# Altium project UPS.PrjPcb (part 3 of 3)

## Sheet BuckBoost.SchDoc
size A4; SheetNumber: 5; SheetTotal: 5
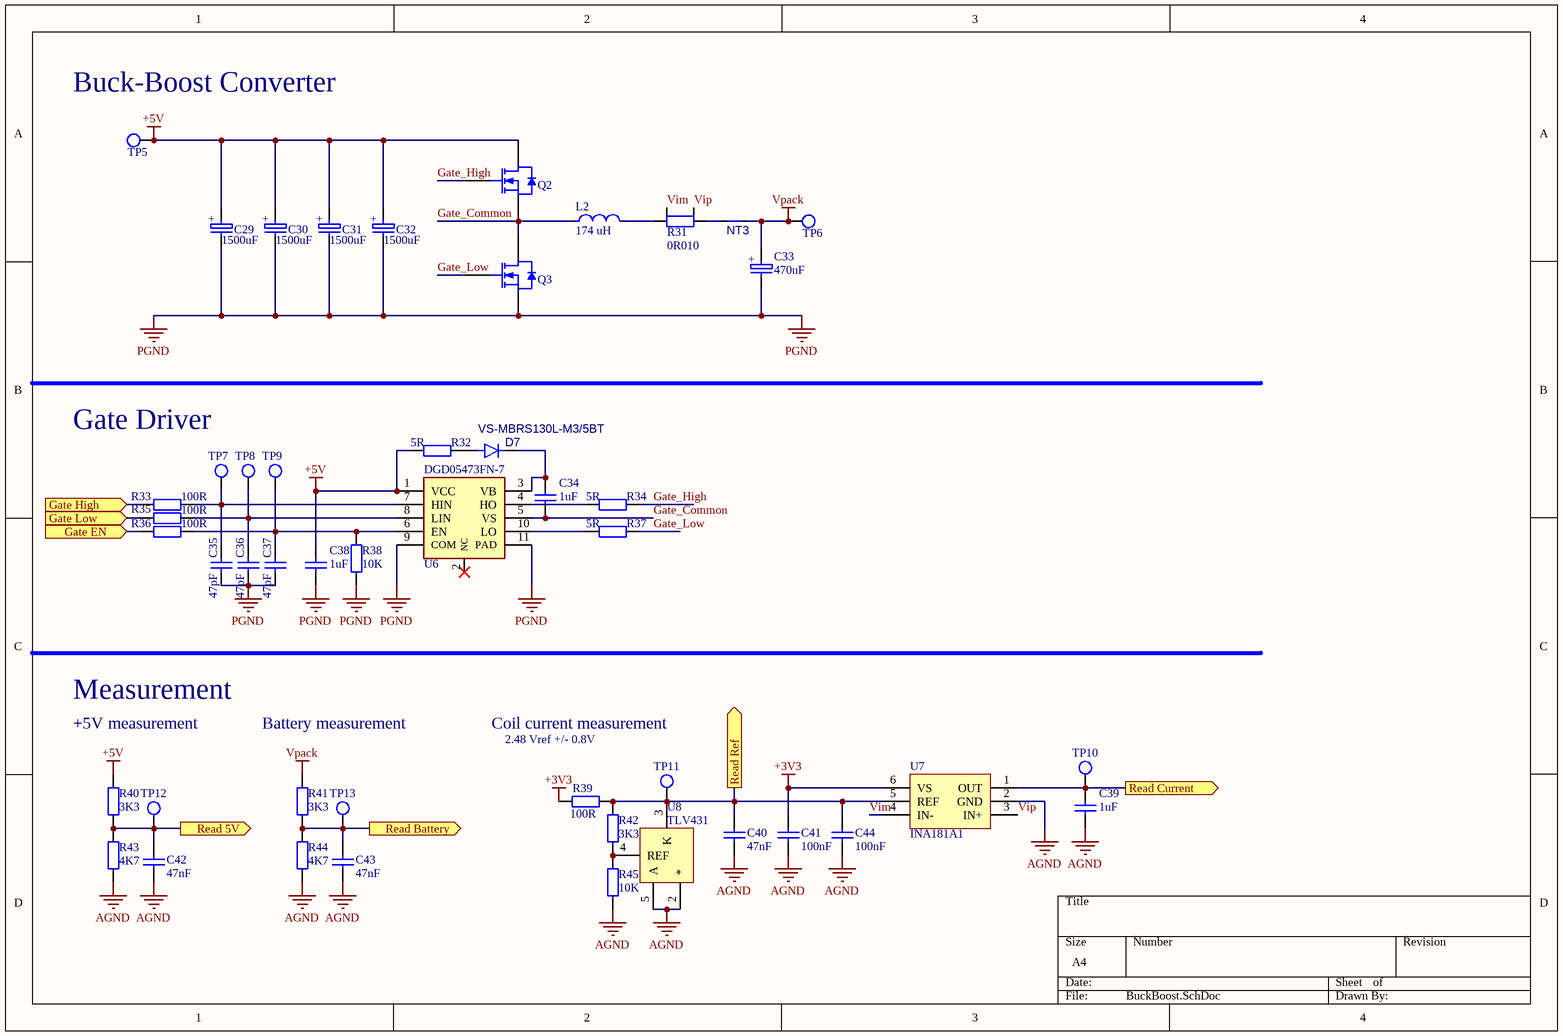
[diagram p4: BuckBoost.SchDoc]

### Parts
C29  value 1500uF  [Aluminium Capacitor 10x12.5]  (hidden comment: RNU0J152MDN1PH)
C30  value 1500uF  [Aluminium Capacitor 10x12.5]  (hidden comment: RNU0J152MDN1PH)
C31  value 1500uF  [Aluminium Capacitor 10x12.5]  (hidden comment: RNU0J152MDN1PH)
C32  value 1500uF  [Aluminium Capacitor 10x12.5]  (hidden comment: RNU0J152MDN1PH)
C33  470uF  [Aluminium Capacitor 10x12.5]
C34  1uF  [CAP0603]
C35  47pF  [CAP0603]
C36  47pF  [CAP0603]
C37  47pF  [CAP0603]
C38  1uF  [CAP0603]
C39  1uF  [CAP0603]
C40  47nF  [CAP0603]
C41  100nF  [CAP0603]
C42  47nF  [CAP0603]
C43  47nF  [CAP0603]
C44  100nF  [CAP0603]
D7  VS-MBRS130L-M3/5BT  [SMB]
L2  value 174 uH  [COIL_HANDMADE]  (hidden comment: Inductor)
NT3  NetTie_1-1  [NETTIE_1.85MM]  (value not drawn)  (net tie, no BOM)
Q2  N-MOSFET  [SOT-669-5]  (value not drawn)
Q3  N-MOSFET  [SOT-669-5]  (value not drawn)
R31  0R010  [RES1206_KELVIN]
R32  5R  [RES0603]
R33  100R  [RES0603]
R34  5R  [RES0603]
R35  100R  [RES0603]
R36  100R  [RES0603]
R37  5R  [RES0603]
R38  10K  [RES0603]
R39  100R  [RES0603]
R40  3K3  [RES0603]
R41  3K3  [RES0603]
R42  3K3  [RES0603]
R43  4K7  [RES0603]
R44  4K7  [RES0603]
R45  10K  [RES0603]
TP5  Test Point  [TP-1.5HOLE]  (value not drawn)
TP6  Test Point  [TP-1.5HOLE]  (value not drawn)
TP7  Test Point  [TP-1.5HOLE]  (value not drawn)
TP8  Test Point  [TP-1.5HOLE]  (value not drawn)
TP9  Test Point  [TP-1.5HOLE]  (value not drawn)
TP10  Test Point  [TP-1.5HOLE]  (value not drawn)
TP11  Test Point  [TP-1.5HOLE]  (value not drawn)
TP12  Test Point  [TP-1.5HOLE]  (value not drawn)
TP13  Test Point  [TP-1.5HOLE]  (value not drawn)
U6  DGD05473FN-7  [V-DFN3030-10]
U7  INA181A1  [SOT23-6]
U8  TLV431  [SOT23-5]

### Ports
Gate EN (in, see Main[2C], uC[3C]), Gate High (in, see Main[2C], uC[3C]), Gate Low (in, see Main[2C], uC[3C]), Read 5V (out, see Main[2C], uC[1C]), Read Battery (out, see Main[2C], uC[1C]), Read Current (out, see Main[2C], uC[1C]), Read Ref (out, see Main[2C], uC[1C])

### Nets
+3V3: C41.1 R39.1 U7.6(VS)
+5V: C29.2(A) C30.2(A) C31.2(A) C32.2(A) C38.2 Q2.3(D) R32.1 R40.2 TP5.1 U6.1(VCC)
AGND: C39.1 C40.1 C41.2 C42.1 C43.1 C44.2 R43.1 R44.1 R45.1 U7.2(GND) U8.2 U8.5(A)
PGND: C29.1(C) C30.1(C) C31.1(C) C32.1(C) C33.1(C) C35.1 C36.1 C37.1 C38.1 Q3.2(S) R38.2 U6.9(COM) U6.11(PAD)
Vpack: C33.2(A) NT3.2 R41.2 TP6.1
Gate EN: R36.1 ; port Gate EN
Gate High: R33.1 ; port Gate High
Gate Low: R35.1 ; port Gate Low
Gate_Common: C34.1 L2.1 Q2.2(S) Q3.3(D) U6.5(VS)
Gate_High: Q2.1(G) R34.2
Gate_Low: Q3.1(G) R37.2
Read 5V: C42.2 R40.1 R43.2 TP12.1 ; port Read 5V
Read Battery: C43.2 R41.1 R44.2 TP13.1 ; port Read Battery
Read Current: C39.2 TP10.1 U7.1(OUT) ; port Read Current
Read Ref: C40.2 C44.1 R39.2 R42.2 TP11.1 U7.5(REF) U8.3(K) ; port Read Ref
Vim: R31.3 U7.4(IN-)
Vip: R31.4 U7.3(IN+)
NetC34_2: C34.2 D7.1(K) U6.3(VB)
NetC35_2: C35.2 R33.2 TP7.1 U6.7(HIN)
NetC36_2: C36.2 R35.2 TP8.1 U6.8(LIN)
NetC37_2: C37.2 R36.2 R38.1 TP9.1 U6.6(EN)
NetD7_2: D7.2(A) R32.2
NetL2_2: L2.2 R31.1
NetNT3_1: NT3.1 R31.2
NetR34_1: R34.1 U6.4(HO)
NetR37_1: R37.1 U6.10(LO)
NetR42_1: R42.1 R45.2 U8.4(REF)

Not connected (* = marked no-connect by the designer): U6 2(NC)*

### Notes on the sheet
- (near TP5) Buck-Boost Converter
- Gate Driver
- Measurement
- +5V measurement
- Battery measurement
- Coil current measurement
- 2.48 Vref +/- 0.8V
- (in symbol RNU0J152MDN1PH) +
- (in symbol RR50J471MDN1KX) +
- (in symbol 1500uF) +

### Library data of the parts
C29-C32 = RNU0J152MDN1PH: Aluminum Electrolytic Capacitor, Polarized, Aluminum (solid Polymer), 6.3V, 20% +Tol, 20% -Tol, 1500uF, Through Hole Mount; Manufacturer: Nichicon; Manufacturer Series: NU; Dielectric Material: Aluminium; ESR (Equivalent Series Resistance): 7mR; Leakage Current: 1.89mA; Ripple Current: 6.1A; Tan Delta: 0.08; Supplier: Future Electronics; Supplier Part Number: 4133684; Manufacturer Part Number: RNU0J152MDN1PH; RoHS: Yes; Category: Polymer Capacitors; Stock: 1000; Pricing: 500=0.37, 1000=0.36, 2000=0.35, 2500=0.35, 7500=0.335 (USD); Mounting Technology: Through Hole; Pins: 2; Package Shape: Cylindrical; Terminal Finish: Tin; Min Operating Temperature: -55°C; Max Operating Temperature: 105°C; JESD-609 Code: e3; Polarity: Polarized; Capacitor Type: Aluminium; Tolerance  (fill in as +-): 20%; Package Style: RadialMeter; Packaging: Tape and Reel; Tolerance (fill in as +-): 20%; Rated DC Voltage (URdc): 6.3V; Series: NU; Termination: Wire; Diameter: 10mm; Length: 12.5mm; Terminal Pitch: 5mm; Reach SVHC Compliant: Yes; RoHS Compliant: Yes; ComponentLink1URL: https://datasheet.ciiva.com:443/pdfs/VipMasterIC/IC/NICH/NICH-S-A0001375683/NICH-S-A0001375683-1.pdf?src-supplier=IHS+Markit; ComponentLink1Description: https://datasheet.ciiva.com:443/pdfs/VipMasterIC/IC/NICH/NICH-S-A0001375683/NICH-S-A0001375683-1.pdf?src-supplier=IHS+Markit; ComponentLink2URL: https://datasheet.ciiva.com/6316/2013fpcap-catalog-nu-6316953.pdf?src-supplier=Digikey; ComponentLink2Description: https://datasheet.ciiva.com/6316/2013fpcap-catalog-nu-6316953.pdf?src-supplier=Digikey; ComponentLink3URL: https://datasheet.ciiva.com/6316/2013fpcap-catalog-nu-6316955.pdf?src-supplier=Digikey; ComponentLink3Description: https://datasheet.ciiva.com/6316/2013fpcap-catalog-nu-6316955.pdf?src-supplier=Digikey
C33 = RR50J471MDN1KX: Aluminum Electrolytic Capacitor, Aluminum (solid Polymer); Manufacturer: Nichicon; Dielectric Material: Aluminium; Supplier: Mouser; Supplier Part Number: 647-RR50J471MDN1KX; Manufacturer Part Number: RR50J471MDN1KX; RoHS: Yes; Category: Polymer Capacitors; Stock: 272; Pricing: 1=0.65, 10=0.409, 50=0.409, 100=0.334, 1000=0.265, 10000=0.265 (USD); Pins: 2; Capacitor Type: Aluminium; Reach SVHC Compliant: Yes; RoHS Compliant: Yes; ComponentLink1URL: https://datasheet.ciiva.com:443/pdfs/VipMasterIC/IC/NICH/NICH-S-A0003527494/NICH-S-A0003527494-1.pdf?src-supplier=IHS+Markit; ComponentLink1Description: https://datasheet.ciiva.com:443/pdfs/VipMasterIC/IC/NICH/NICH-S-A0003527494/NICH-S-A0003527494-1.pdf?src-supplier=IHS+Markit; ComponentLink2URL: http://www.mouser.com/ds/2/293/e-rr5-875910.pdf?src-supplier=Mouser; ComponentLink2Description: http://www.mouser.com/ds/2/293/e-rr5-875910.pdf?src-supplier=Mouser; ComponentLink3URL: http://nichicon-us.com/english/products/pdfs/e-rr5.pdf?src-supplier=Digikey; ComponentLink3Description: http://nichicon-us.com/english/products/pdfs/e-rr5.pdf?src-supplier=Digikey; Value: 470uF
C34 C38 C39 = 1uF: Capacitor; Voltage: *; Value: 1uF
C35-C37 = 47pF: Ceramic Capacitor, Multilayer, Ceramic, 100V, 5% +Tol, 5% -Tol, C0G, 30ppm/Cel TC, 0.000047uF, Surface Mount, 0603; Manufacturer: KEMET; Manufacturer Part Number: C0603C470J1GACTU; Multilayer: Yes; Voltage: *; Supplier: Mouser; Supplier Part Number: 80-C0603C470J1G; RoHS: Yes; Category: Ceramic Capacitors; Stock: 43381; Pricing: 1=0.1, 10=0.026, 50=0.026, 100=0.016, 1000=0.012, 10000=0.007 (USD); Mounting Technology: Surface Mount; Pins: 2; Dielectric Material: Ceramic; Package Shape: Rectangular; Case/Package: 0603; Terminal Finish: Nickel; Min Operating Temperature: -55°C; Max Operating Temperature: 125°C; JESD-609 Code: e3; Capacitor Type: Ceramic; Tolerance  (fill in as +-): 5%; Package Style: SMTMeter; Packaging: Tape and Reel; Tolerance (fill in as +-): 5%; Rated DC Voltage (URdc): 100V; Temperature Characteristics Code: C0G; Termination: Wraparound; Length: 1.6mm; Width: 0.8mm; Height: 0.8mm; Reach SVHC Compliant: Yes; RoHS Compliant: Yes; ComponentLink1URL: https://datasheet.ciiva.com:443/pdfs/VipMasterIC/IC/KEME/KEME-S-A0005605168/KEME-S-A0005605168-1.pdf?src-supplier=IHS+Markit; ComponentLink1Description: https://datasheet.ciiva.com:443/pdfs/VipMasterIC/IC/KEME/KEME-S-A0005605168/KEME-S-A0005605168-1.pdf?src-supplier=IHS+Markit; ComponentLink2URL: https://datasheet.ciiva.com/28668/1789732-28668693.pdf?src-supplier=Element14; ComponentLink2Description: https://datasheet.ciiva.com/28668/1789732-28668693.pdf?src-supplier=Element14; ComponentLink3URL: https://datasheet.ciiva.com/18193/getdatasheetpartid-544691-18193046.pdf?src-supplier=Verical; ComponentLink3Description: https://datasheet.ciiva.com/18193/getdatasheetpartid-544691-18193046.pdf?src-supplier=Verical; ComponentLink4URL: https://datasheet.ciiva.com/18101/getdatasheetpartid-38001-18101098.pdf?src-supplier=Verical; ComponentLink4Description: https://datasheet.ciiva.com/18101/getdatasheetpartid-38001-18101098.pdf?src-supplier=Verical; Value: 47pF
C40 C42 C43 = 47nF: Capacitor; Voltage: *; Value: 47nF
C41 C44 = 100nF: Capacitor; Voltage: *; Value: 100nF
D7 = VS-MBRS130L-M3/5BT: Rectifier Diode, Schottky, 1 Phase, 1 Element, 30V V(RRM), Silicon; Manufacturer: Vishay Semiconductors; Package Body Material: Plastic; Additional Feature: FREE WHEELING DIODE; Number of Elements: 1; If: 1 A; Vf: 300 mV; Supplier: Mouser; Supplier Part Number: 78-VS-MBRS130L-M35BT; Manufacturer Part Number: VS-MBRS130L-M3/5BT; RoHS: Yes; Category: Rectifier Diodes; Stock: 107658; Pricing: 1=0.26, 10=0.211, 50=0.211, 100=0.15, 1000=0.105, 10000=0.08 (USD); Pins: 2; Diode Element Material: SILICON; Package Shape: Rectangular; Terminal Finish: Tin; Min Operating Temperature: -55°C; Max Operating Temperature: 125°C; JESD-609 Code: e3; Diode Type: RECTIFIER; JESD-30 Code: R-PDSO-C2; Moisture Sensitivity Level: 1; Package Style: SMALL OUTLINEMeter; Rep Pk Reverse Voltage-Max: 30V; Surface Mount: Yes; Technology: SCHOTTKY; Terminal Form: C BEND; Terminal Position: DUAL; RoHS Compliant: Yes; Reach SVHC Compliant: No; ComponentLink1URL: https://datasheet.ciiva.com:443/pdfs/VipMasterIC/IC/VISH/VISH-S-A0001785244/VISH-S-A0001785244-1.pdf?src-supplier=IHS+Markit; ComponentLink1Description: https://datasheet.ciiva.com:443/pdfs/VipMasterIC/IC/VISH/VISH-S-A0001785244/VISH-S-A0001785244-1.pdf?src-supplier=IHS+Markit; ComponentLink2URL: http://www.mouser.com/ds/2/427/vsmbrs130lm3-552915.pdf?src-supplier=Mouser; ComponentLink2Description: http://www.mouser.com/ds/2/427/vsmbrs130lm3-552915.pdf?src-supplier=Mouser; ComponentLink3URL: http://www.vishay.com/docs/95745/vsmbrs130lm3.pdf?src-supplier=Digikey; ComponentLink3Description: http://www.vishay.com/docs/95745/vsmbrs130lm3.pdf?src-supplier=Digikey; ComponentLink4URL: https://datasheet.octopart.com/VS-MBRS130L-M3-5BT-Vishay-datasheet-41960962.pdf?src-supplier=Future+Electronics; ComponentLink4Description: https://datasheet.octopart.com/VS-MBRS130L-M3-5BT-Vishay-datasheet-41960962.pdf?src-supplier=Future+Electronics; Vrrm: 30 V
L2 = Inductor: Hand made inductance
NT3 = NetTie_1-1: NetTie 1 -> 1; ID: 22; Value: NetTie 1-1 0.2mm; Inventory_Category: Other; Part Class: NetTie; Technology: SMT
Q2 Q3 = PSMN1R2-25YLDX: Power Field-Effect Transistor, 100A I(D), 25V, 0.00169ohm, 1-Element, N-Channel, Silicon, Metal-oxide Semiconductor FET, MO-235; Manufacturer: Nexperia; Package Body Material: Plastic; Additional Feature: HIGH RELIABILITY; Avalanche Energy Rating (Eas): 1293mJ; Case Connection: DRAIN; Drain-source On Resistance-Max: 1.69mR; Number of Elements: 1; Operating Mode: ENHANCEMENT MODE; Pulsed Drain Current-Max (IDM): 1.163kA; Transistor Application: SWITCHING; Reference Standard: IEC-60134; Supplier: Mouser; Supplier Part Number: 771-PSMN1R2-25YLDX; Manufacturer Part Number: PSMN1R2-25YLDX; RoHS: Yes; Category: Transistors; Stock: 20971; Pricing: 1=0.7, 10=0.694, 50=0.694, 100=0.663, 1000=0.483, 10000=0.481 (USD); Pins: 4; Package Shape: Rectangular; Transistor Element Material: SILICON; Polarity/Channel Type: N-CHANNEL; Drain Current-Max (ID): 100A; DS Breakdown Voltage-Min: 25V; FET Technology: METAL-OXIDE SEMICONDUCTOR; Package Style: SMALL OUTLINEMeter; Surface Mount: Yes; Terminal Form: Gull Wing; Terminal Position: SINGLE; JEDEC-95 Code: MO-235; Reach SVHC Compliant: No; RoHS Compliant: Yes; ComponentLink1URL: https://datasheet.ciiva.com:443/pdfs/VipMasterIC/IC/NEXP/NEXP-S-A0003107917/NEXP-S-A0003107917-1.pdf?src-supplier=IHS+Markit; ComponentLink1Description: https://datasheet.ciiva.com:443/pdfs/VipMasterIC/IC/NEXP/NEXP-S-A0003107917/NEXP-S-A0003107917-1.pdf?src-supplier=IHS+Markit
R31 = 0R010: Resistor Current Sense Metal Foil 1206 10m Ohm 1% 1W ±50ppm/°C T/R; Manufacturer: Eaton; Manufacturer Part Number: MFSA1206R0050FCM; Supplier Part Number: 504-MFSA1206R0050FCM; RoHS: No; Category: Chip SMD Resistors; Stock: 9199; Pricing: 1=0.21, 10=0.173, 50=0.173, 100=0.128, 1000=0.096, 10000=0.062 (USD); Temperature Coefficient: 50ppm/°C; Value: 0R010
R32 R34 R37 = 5R: Resistor; Value: 5R
R33 R35 R36 R39 = 100R: Resistor; Value: 100R
R38 R45 = 10K: Resistor; Value: 10K
R40-R42 = 3K3: Fixed Resistor, Metal Glaze/thick Film, 0.1W, 3300ohm, 75V, 1% +/-Tol, 150ppm/Cel, Surface Mount, 0603; Manufacturer: Yageo; Manufacturer Part Number: RC0603FR-073K3P; Additional Feature: LASER TRIMMABLE; Rated Temperature: 70°C; Temperature Coefficient: 150ppm/°C; Supplier Part Number: 603-RC0603FR-073K3P; RoHS: Yes; Category: Chip SMD Resistors; Stock: 14148; Pricing: 1=0.1, 10=0.017, 50=0.017, 100=0.01, 1000=0.008, 10000=0.004 (USD); Mounting Technology: Surface Mount; Pins: 2; Package Shape: Rectangular; Case/Package: 0603; Terminal Finish: Nickel; Min Operating Temperature: -55°C; Max Operating Temperature: 155°C; JESD-609 Code: e3; Resistor Type: FIXED RESISTOR; Packaging: Tape and Reel; Technology: METAL GLAZE/THICK FILM; Termination: Wraparound; Working Voltage: 75V; Reach SVHC Compliant: Yes; RoHS Compliant: Yes; ComponentLink1URL: https://datasheet.ciiva.com:443/pdfs/VipMasterIC/IC/YAGO/YAGO-S-A0006248068/YAGO-S-A0006248068-1.pdf?src-supplier=IHS+Markit; ComponentLink1Description: https://datasheet.ciiva.com:443/pdfs/VipMasterIC/IC/YAGO/YAGO-S-A0006248068/YAGO-S-A0006248068-1.pdf?src-supplier=IHS+Markit; ComponentLink2URL: http://www.yageo.com.tw/exep/pages/download/literatures/PYu-R_INT-thick_7.pdf?src-supplier=Digikey; ComponentLink2Description: http://www.yageo.com.tw/exep/pages/download/literatures/PYu-R_INT-thick_7.pdf?src-supplier=Digikey; ComponentLink3URL: http://www.yageo.com/NewPortal/yageodocoutput?fileName=/pdf/R-Chip/PYu-RC_51_RoHS_P_0.pdf&src-supplier=Digikey; ComponentLink3Description: http://www.yageo.com/NewPortal/yageodocoutput?fileName=/pdf/R-Chip/PYu-RC_51_RoHS_P_0.pdf&src-supplier=Digikey; Value: 3K3
R43 R44 = 4K7: Resistor; Value: 4K7
U6 = DGD05473FN-7: HIGH FREQUENCY HIGH-SIDE AND LOW-SIDE GATE DRIVER; Manufacturer_Name: Diodes Incorporated; Datasheet Link: https://www.diodes.com/assets/Datasheets/DGD05473.pdf; Height: 0.8mm; Manufacturer_Part_Number: DGD05473FN-7; Mouser Part Number: 621-DGD05473FN-7; Mouser Price/Stock: https://www.mouser.co.uk/ProductDetail/Diodes-Incorporated/DGD05473FN-7?qs=W0yvOO0ixfECV6JdMBa%2F6g%3D%3D; Arrow Part Number: DGD05473FN-7; Arrow Price/Stock: https://www.arrow.com/en/products/dgd05473fn-7/diodes-incorporated?region=nac
U7 = INA181A1: Operational Amplifier, 1 Func, 500uV Offset-Max, PDSO6; Manufacturer: Texas Instruments; Manufacturer Part Number: INA181A1IDBVR; Package Body Material: Plastic; Average Bias Current-Max (IIB): 75uA; Common-mode Reject Ratio-Nom: 100dB; Channels: 1; Slew Rate: 2V/µs; Supply Voltage Limit-Max: 5.5V; Nominal Supply Voltage: 5V; Unity Gain BW-Nom: 350kHz; Supplier: Mouser; Supplier Part Number: 595-INA181A1IDBVR; RoHS: Yes; Category: Amplifiers - Op Amps, Buffer, Instrumentation; Stock: 103029; Pricing: 1=0.43, 10=0.256, 50=0.256, 100=0.198, 1000=0.169, 10000=0.147 (USD); Case/Package: SOP; Pins: 6; Package Shape: Rectangular; Terminal Finish: Tin; Min Operating Temperature: -40°C; Max Operating Temperature: 125°C; JESD-609 Code: e3; Amplifier Type: OPERATIONAL AMPLIFIER; Input Offset Voltage-Max: 500uV; JESD-30 Code: R-PDSO-G6; Moisture Sensitivity Level: 1; Package Style: SMALL OUTLINEMeter; Peak Reflow Temperature (Cel): 260°C; Surface Mount: Yes; Terminal Form: Gull Wing; Terminal Position: DUAL; Temperature Grade: AUTOMOTIVE; Reach SVHC Compliant: Yes; RoHS Compliant: Yes; ComponentLink1URL: https://www.ti.com:443/lit/ds/symlink/ina181.pdf?src-supplier=IHS+Markit; ComponentLink1Description: https://www.ti.com:443/lit/ds/symlink/ina181.pdf?src-supplier=IHS+Markit; ComponentLink2URL: http://www.ti.com/lit/ds/symlink/ina181.pdf?src-supplier=Digikey; ComponentLink2Description: http://www.ti.com/lit/ds/symlink/ina181.pdf?src-supplier=Digikey
U8 = TLV431: Three Terminal Voltage Reference, 1 Output, 1.24V, Trim/Adjustable, BIPolar, PDSO5; Manufacturer: Texas Instruments; Manufacturer Part Number: TLV431CDBVR; Package Body Material: Plastic; Channels: 1; Max Output current: 10mA; Max Output Voltage: 1.258V; Min Output Voltage: 1.222V; Package Equivalence Code: TSOP5/6,.11,37; Max Supply Voltage: 6V; Temp Coef of Voltage-Max: 138.249ppm/°C; Trim/Adjustable Output: Yes; Qualification Status: Not Qualified; Supplier: Mouser; Supplier Part Number: 595-TLV431CDBVR; RoHS: Yes; Category: Voltage References; Stock: 5017; Pricing: 1=0.34, 10=0.274, 50=0.274, 100=0.203, 1000=0.138, 10000=0.137 (USD); Case/Package: LSSOP; Pins: 5; Package Shape: Rectangular; Terminal Finish: Nickel; Min Operating Temperature: 0°C; Max Operating Temperature: 70°C; JESD-609 Code: e4; Throw Configuration: THREE TERMINAL VOLTAGE REFERENCE; JESD-30 Code: R-PDSO-G5; Moisture Sensitivity Level: 1; Number of Outputs: 1; Nominal Output Voltage: 1.24V; Package Style: SMALL OUTLINE, LOW PROFILE, SHRINK PITCHMeter; Peak Reflow Temperature (Cel): 260°C; Min Supply Voltage: 1.24V; Surface Mount: Yes; Technology: BIPOLAR; Terminal Form: Gull Wing; Terminal Position: DUAL; Length: 2.9mm; Width: 1.6mm; Height - Seated (Max): 1.45mm; Terminal Pitch: 0.95mm; Temperature Grade: COMMERCIAL; Reach SVHC Compliant: Yes; RoHS Compliant: Yes; ComponentLink1URL: https://www.ti.com:443/lit/ds/symlink/tlv431.pdf?src-supplier=IHS+Markit; ComponentLink1Description: https://www.ti.com:443/lit/ds/symlink/tlv431.pdf?src-supplier=IHS+Markit; ComponentLink2URL: https://datasheet.ciiva.com/4065/29560336s9640988n7713-4065870.pdf?src-supplier=Arrow+Electronics; ComponentLink2Description: https://datasheet.ciiva.com/4065/29560336s9640988n7713-4065870.pdf?src-supplier=Arrow+Electronics; ComponentLink3URL: https://datasheet.ciiva.com/2006/tlv431a-2006342.pdf?src-supplier=Digikey; ComponentLink3Description: https://datasheet.ciiva.com/2006/tlv431a-2006342.pdf?src-supplier=Digikey; ComponentLink4URL: https://datasheet.ciiva.com/2006/tlv431a-2006343.pdf?src-supplier=Digikey; ComponentLink4Description: https://datasheet.ciiva.com/2006/tlv431a-2006343.pdf?src-supplier=Digikey; ComponentLink5URL: https://datasheet.ciiva.com/2006/tlv431a-2006344.pdf?src-supplier=Digikey; ComponentLink5Description: https://datasheet.ciiva.com/2006/tlv431a-2006344.pdf?src-supplier=Digikey

## Nets that join several sheets
+3V3: uC (15 pins), Communication (7 pins), Power (C24.2 JP3.2 L1.1 R27.2), BuckBoost (C41.1 R39.1 U7.6)
+3V3A: uC (C14.2 U2.22), Power (C25.2 L1.2)
+5V: Communication (JP4.2), Power (8 pins), BuckBoost (10 pins)
AGND: uC (C14.1 C20.1 U2.17 U2.21), Power (C25.1 NT2.2), BuckBoost (12 pins)
DGND: uC (23 pins), Communication (17 pins), Power (12 pins)
PGND: Power (12 pins), BuckBoost (13 pins)
Vpack: Power (7 pins), BuckBoost (C33.2 NT3.2 R41.2 TP6.1)
Gate EN: uC (U2.53), BuckBoost (R36.1)
Gate High: uC (U2.52), BuckBoost (R33.1)
Gate Low: uC (U2.51), BuckBoost (R35.1)
Path Status: uC (U2.64), Power (C28.2 R25.2 U4.8)
Read 5V: uC (U2.24), BuckBoost (C42.2 R40.1 R43.2 TP12.1)
Read Battery: uC (U2.25), BuckBoost (C43.2 R41.1 R44.2 TP13.1)
Read Current: uC (U2.12), BuckBoost (C39.2 TP10.1 U7.1)
Read Ref: uC (U2.20), BuckBoost (7 pins)
SERIAL_TX: uC (CN1.1 U2.1), Communication (R4.2 TP1.1)
System Reset: uC (U2.63), Power (R21.2 SW3.2)